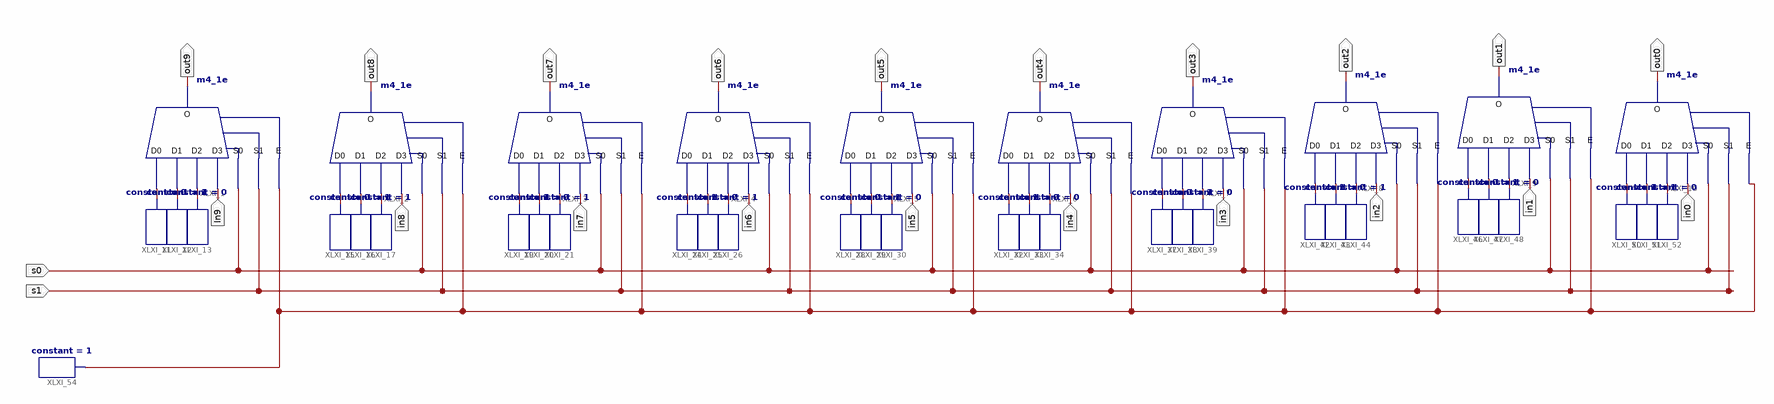
[diagram p0: schematic sheet 1]
// Xilinx ISE schematic DefaultWithdraw.sch (xc9500xl) as structural Verilog: 41 symbols, 22 ports
module DefaultWithdraw (
  input  s0,
  input  s1,
  input  In9,
  input  in8,
  input  in7,
  input  in6,
  input  in5,
  input  in4,
  input  in3,
  input  in2,
  input  in1,
  input  in0,
  output out0,
  output out1,
  output out2,
  output out3,
  output out4,
  output out5,
  output out6,
  output out7,
  output out8,
  output out9
);

  wire XLXN_1, XLXN_2, XLXN_3, XLXN_5, XLXN_6, XLXN_7, XLXN_9, XLXN_10, XLXN_11, XLXN_13, XLXN_14, XLXN_15,
       XLXN_17, XLXN_18, XLXN_19, XLXN_21, XLXN_22, XLXN_23, XLXN_26, XLXN_27, XLXN_28, XLXN_30, XLXN_31,
       XLXN_32, XLXN_34, XLXN_35, XLXN_36, XLXN_38, XLXN_39, XLXN_40, XLXN_46;

  m4_1e XLXI_1 (.D0(XLXN_1), .D1(XLXN_2), .D2(XLXN_3), .D3(In9), .E(XLXN_46), .S0(s0), .S1(s1), .O(out9));
  m4_1e XLXI_2 (.D0(XLXN_5), .D1(XLXN_6), .D2(XLXN_7), .D3(in8), .E(XLXN_46), .S0(s0), .S1(s1), .O(out8));
  m4_1e XLXI_3 (.D0(XLXN_9), .D1(XLXN_10), .D2(XLXN_11), .D3(in7), .E(XLXN_46), .S0(s0), .S1(s1), .O(out7));
  m4_1e XLXI_4 (.D0(XLXN_13), .D1(XLXN_14), .D2(XLXN_15), .D3(in6), .E(XLXN_46), .S0(s0), .S1(s1), .O(out6));
  m4_1e XLXI_5 (.D0(XLXN_17), .D1(XLXN_18), .D2(XLXN_19), .D3(in5), .E(XLXN_46), .S0(s0), .S1(s1), .O(out5));
  m4_1e XLXI_6 (.D0(XLXN_21), .D1(XLXN_22), .D2(XLXN_23), .D3(in4), .E(XLXN_46), .S0(s0), .S1(s1), .O(out4));
  m4_1e XLXI_7 (.D0(XLXN_26), .D1(XLXN_27), .D2(XLXN_28), .D3(in3), .E(XLXN_46), .S0(s0), .S1(s1), .O(out3));
  m4_1e XLXI_8 (.D0(XLXN_30), .D1(XLXN_31), .D2(XLXN_32), .D3(in2), .E(XLXN_46), .S0(s0), .S1(s1), .O(out2));
  m4_1e XLXI_9 (.D0(XLXN_34), .D1(XLXN_35), .D2(XLXN_36), .D3(in1), .E(XLXN_46), .S0(s0), .S1(s1), .O(out1));
  m4_1e XLXI_10 (.D0(XLXN_38), .D1(XLXN_39), .D2(XLXN_40), .D3(in0), .E(XLXN_46), .S0(s0), .S1(s1), .O(out0));
  constant #(.CValue("0")) XLXI_11 (.O(XLXN_1));
  constant #(.CValue("1")) XLXI_12 (.O(XLXN_2));
  constant #(.CValue("0")) XLXI_13 (.O(XLXN_3));
  constant #(.CValue("0")) XLXI_15 (.O(XLXN_5));
  constant #(.CValue("1")) XLXI_16 (.O(XLXN_6));
  constant #(.CValue("1")) XLXI_17 (.O(XLXN_7));
  constant #(.CValue("1")) XLXI_19 (.O(XLXN_9));
  constant #(.CValue("0")) XLXI_20 (.O(XLXN_10));
  constant #(.CValue("1")) XLXI_21 (.O(XLXN_11));
  constant #(.CValue("1")) XLXI_24 (.O(XLXN_13));
  constant #(.CValue("0")) XLXI_25 (.O(XLXN_14));
  constant #(.CValue("1")) XLXI_26 (.O(XLXN_15));
  constant #(.CValue("0")) XLXI_28 (.O(XLXN_17));
  constant #(.CValue("1")) XLXI_29 (.O(XLXN_18));
  constant #(.CValue("0")) XLXI_30 (.O(XLXN_19));
  constant #(.CValue("1")) XLXI_32 (.O(XLXN_21));
  constant #(.CValue("0")) XLXI_33 (.O(XLXN_22));
  constant #(.CValue("0")) XLXI_34 (.O(XLXN_23));
  constant #(.CValue("0")) XLXI_37 (.O(XLXN_26));
  constant #(.CValue("1")) XLXI_38 (.O(XLXN_27));
  constant #(.CValue("0")) XLXI_39 (.O(XLXN_28));
  constant #(.CValue("1")) XLXI_42 (.O(XLXN_30));
  constant #(.CValue("0")) XLXI_43 (.O(XLXN_31));
  constant #(.CValue("1")) XLXI_44 (.O(XLXN_32));
  constant #(.CValue("0")) XLXI_46 (.O(XLXN_34));
  constant #(.CValue("1")) XLXI_47 (.O(XLXN_35));
  constant #(.CValue("0")) XLXI_48 (.O(XLXN_36));
  constant #(.CValue("1")) XLXI_50 (.O(XLXN_38));
  constant #(.CValue("1")) XLXI_51 (.O(XLXN_39));
  constant #(.CValue("0")) XLXI_52 (.O(XLXN_40));
  constant #(.CValue("1")) XLXI_54 (.O(XLXN_46));
endmodule
